# EAGLE design keysweeper_mem_sm (EAGLE 7.5.0)
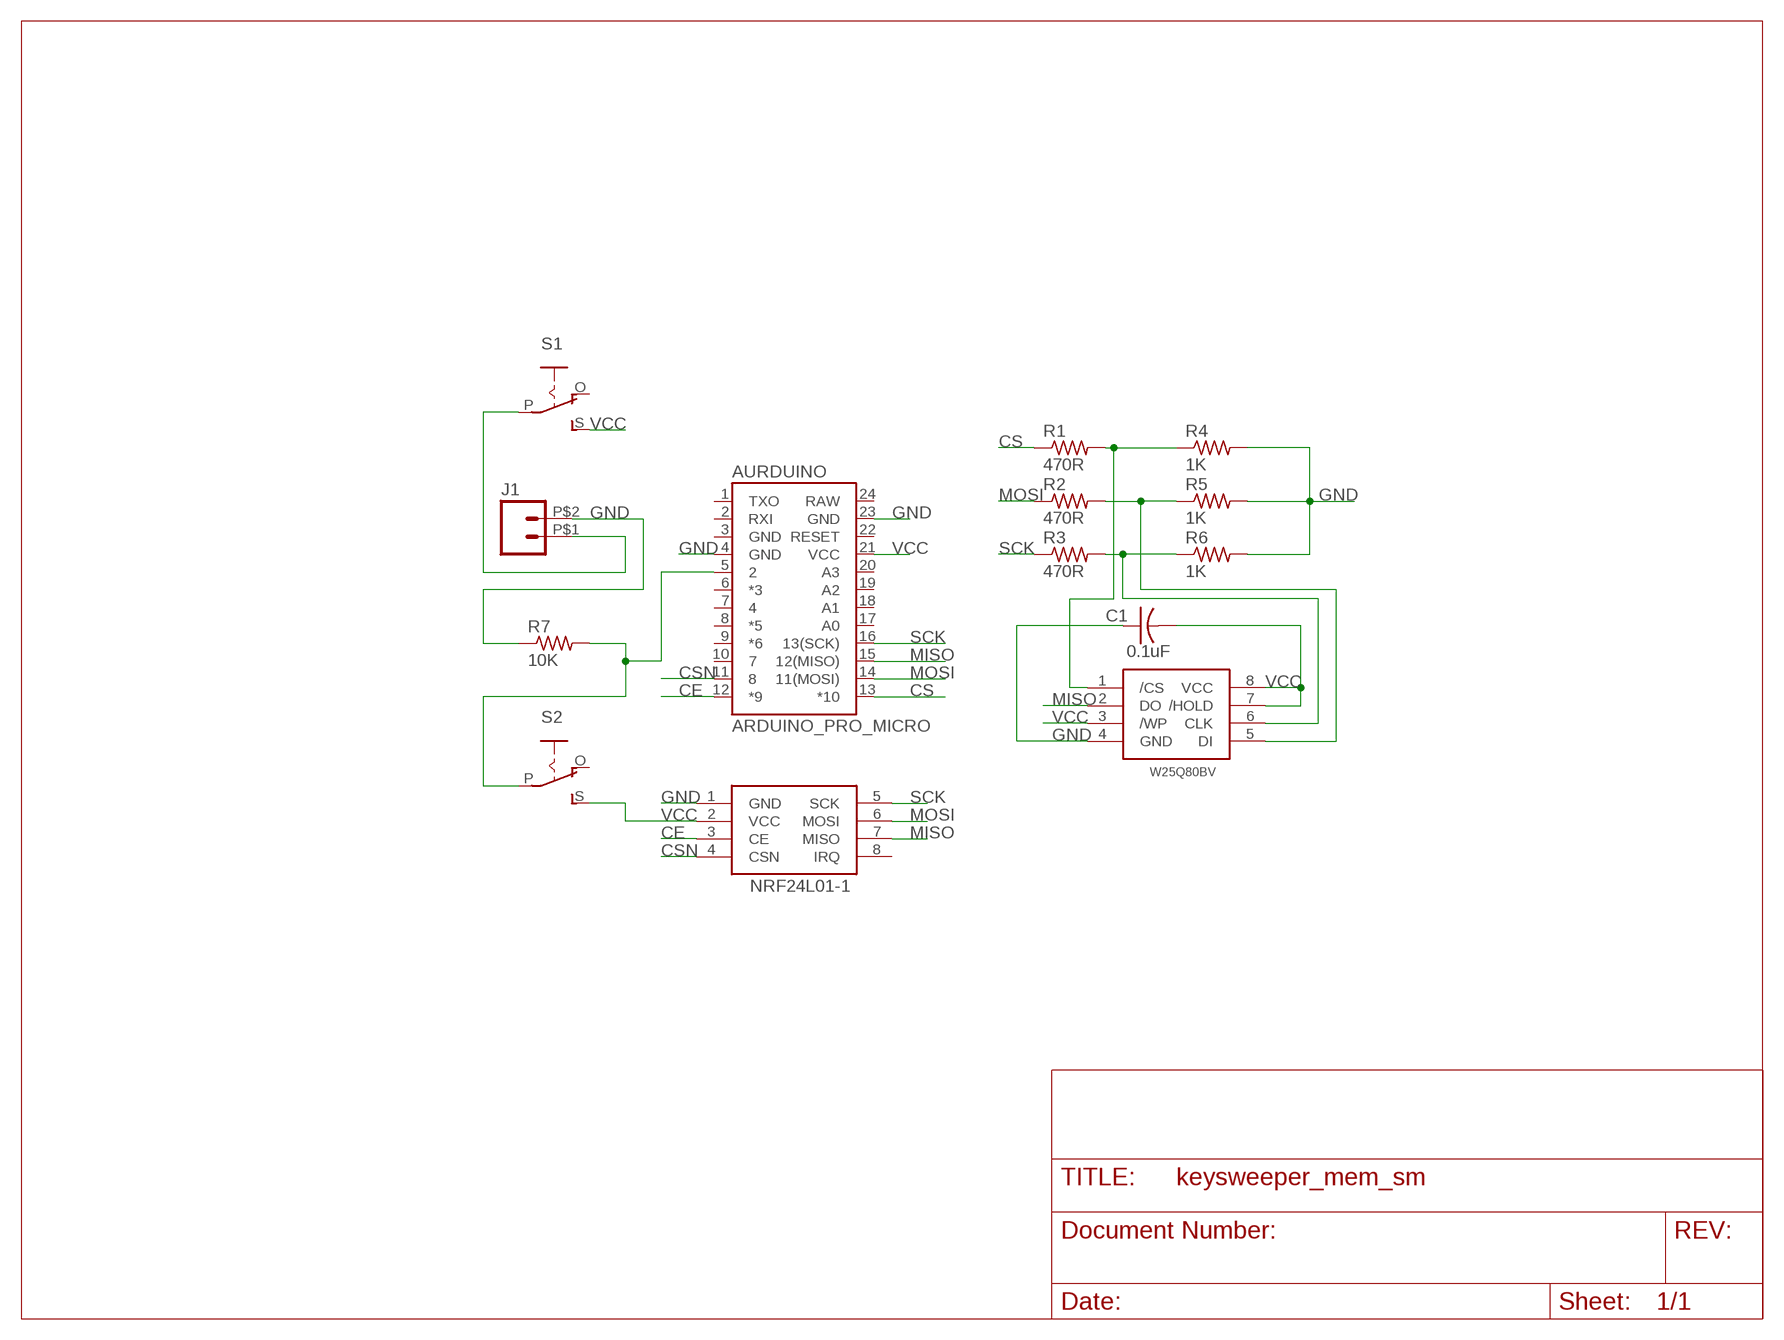
[diagram p0: schematic, sheet 1]

## Parts
AURDUINO  ARDUINO_PRO_MICRO  [ARDUINO_PRO_MICRO]
C1  0.1uF  C-USC0805K  [C0805K]
J1  M02PTH2  [1X02_BIG]
R1  470R  R-US_R0805W  [R0805W]
R2  470R  R-US_R0805W  [R0805W]
R3  470R  R-US_R0805W  [R0805W]
R4  1K  R-US_R0805W  [R0805W]
R5  1K  R-US_R0805W  [R0805W]
R6  1K  R-US_R0805W  [R0805W]
R7  10K  R-US_R0805W  [R0805W]
S1  EG1218S  [EG1218]
S2  EG1218S  [EG1218]
U1  NRF24L01-8PIN  [NRF24L01]
U2  W25Q80BV-SMD  [W25Q80BV-SMD]

## Nets
CE: AURDUINO.12(*9) U1.3(CE)
CS: AURDUINO.13(*10) R1.1
CSN: AURDUINO.11 U1.4(CSN)
GND [power]: AURDUINO.4(GND) AURDUINO.23(GND) C1.1 J1.P$2 R4.2 R5.2 R6.2 R7.1 U1.1(GND) U2.4(GND)
MISO: AURDUINO.15(12(MISO)) U1.7(MISO) U2.2(DO)
MOSI: AURDUINO.14(11(MOSI)) R2.1 U1.6(MOSI)
N$1: R1.2 R4.1 U2.1(/CS)
N$2: R2.2 R5.1 U2.5(DI)
N$3: R3.2 R6.1 U2.6(CLK)
N$5: AURDUINO.5 R7.2 S2.P
N$6: J1.P$1 S1.P
SCK: AURDUINO.16(13(SCK)) R3.1 U1.5(SCK)
VCC [power]: AURDUINO.21(VCC) C1.2 S1.S S2.S U1.2(VCC) U2.3(/WP) U2.7(/HOLD) U2.8(VCC)
Unconnected: AURDUINO.1(TXO) AURDUINO.2(RXI) AURDUINO.3(GND) AURDUINO.6(*3) AURDUINO.7 AURDUINO.8(*5) AURDUINO.9(*6) AURDUINO.10 AURDUINO.17(A0) AURDUINO.18(A1) AURDUINO.19(A2) AURDUINO.20(A3) AURDUINO.22(RESET) AURDUINO.24(RAW) S1.O S2.O U1.8(IRQ)

## Library data of the parts
AURDUINO = SparkFun-Boards:ARDUINO_PRO_MICRO
C1 = adafruit:C-US: CAPACITOR, American symbol
J1 = SparkFun-Connectors:M02: Standard 2-pin 0.1" header. Use with - straight break away headers ( PRT-00116) - right angle break away headers (PRT-00553) - swiss pins (PRT-00743) - machine pins (PRT-00117) - female headers (PRT-00115) Molex polarized connector foot print use with: PRT-08233 with associated crimp pins and housings. 2.54_SCREWTERM for use with PRT-10571. 3.5mm Screw Terminal footprints for PRT-08084 5mm Screw Terminal footprints for use with PRT-08432
R1-R7 = adafruit:R-US_: RESISTOR, American symbol
S1 S2 = adafruit:EG1218: SLIDING SWITCH 0.1" spacing through hole, vertical SPDT slide switch http://www.ladyada.net/library/pcb/eaglelibrary.html
U1 = osok:NRF24L01-8PIN
U2 = osok:W25Q80BV-SMD

## Net classes
0 default: width 0.254 mm
1 power: width 0.508 mm

## Board
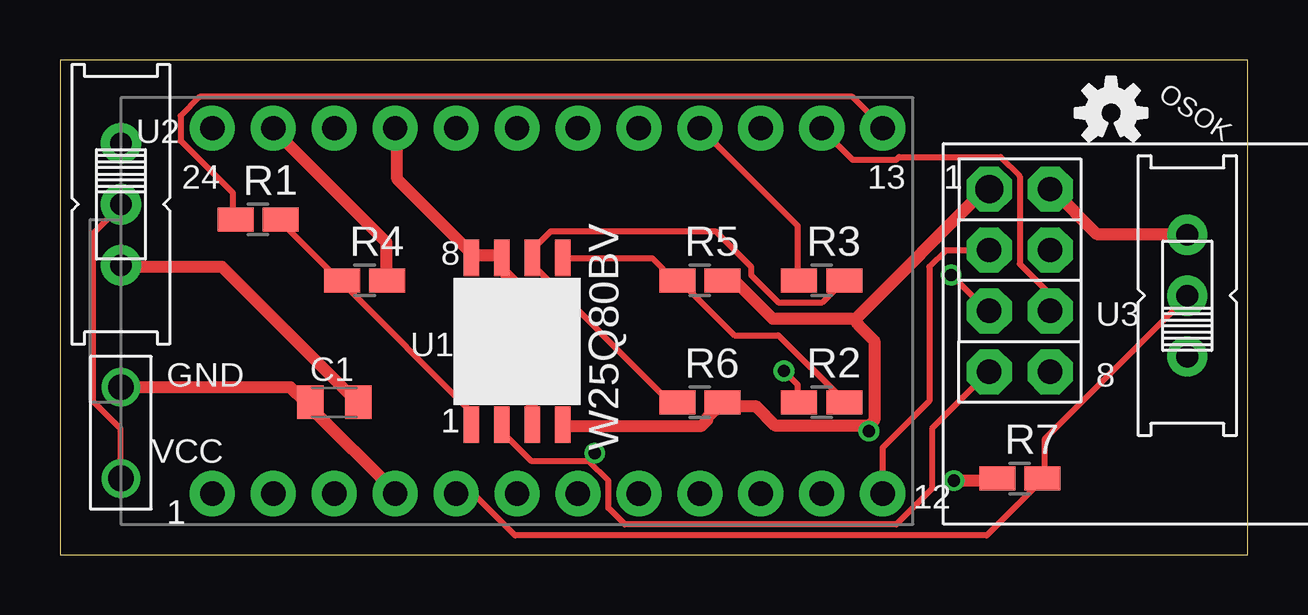
[diagram p1: board, top side]
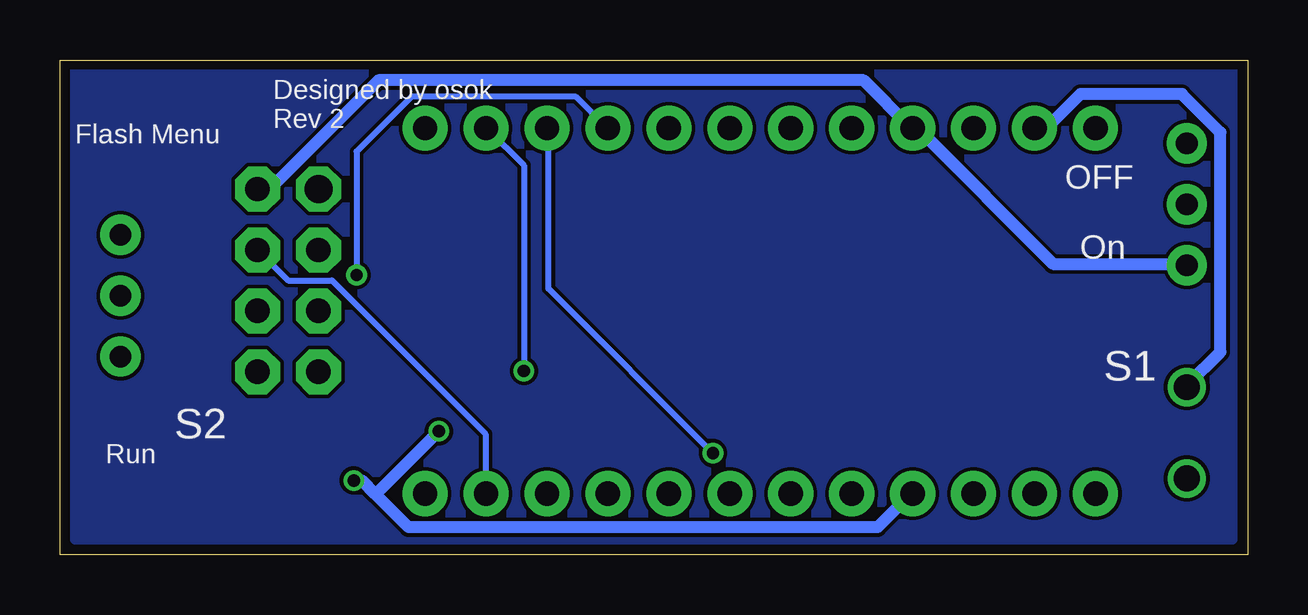
[diagram p2: board, bottom side, seen from below]

Size 49.51 x 20.62 mm. Coordinates in mm from the lower left corner, seen from the top.
Outline: 0,0 49.51,0 49.51,20.62 0,20.62 0,0
Copper layers (1*16): Top 0.0356mm / dielectric 1.5011mm / Bottom 0.0356mm
Design rules "LaenPCBOrder": minimum track width 6mil, minimum drill 13mil, track to track 6mil, track to pad 6mil, pad to pad 6mil, via to via 6mil, smd to smd 6mil, copper to edge 15mil, drill to drill 6mil, minimum pad ring 7mil, minimum via ring 7mil, stop-mask expansion 3mil, vias tented up to drill 0mil, thermal gap 10mil

### Footprints (pad centres in the part's own frame; a part is rotated, then mirrored left to right if it is on the bottom)
ARDUINO_PRO_MICRO = drill 1.016 pad 1.88: 1 -7.62,12.7; 2 -7.62,10.16; 3 -7.62,7.62; 4 -7.62,5.08; 5 -7.62,2.54; 6 -7.62,0; 7 -7.62,-2.54; 8 -7.62,-5.08; 9 -7.62,-7.62; 10 -7.62,-10.16; 11 -7.62,-12.7; 12 -7.62,-15.24; 13 7.62,-15.24; 14 7.62,-12.7; 15 7.62,-10.16; 16 7.62,-7.62; 17 7.62,-5.08; 18 7.62,-2.54; 19 7.62,0; 20 7.62,2.54; 21 7.62,5.08; 22 7.62,7.62; 23 7.62,10.16; 24 7.62,12.7
C0805K = smd 1.1 x 1.4: 1 -1,0; 2 1,0
1X02_BIG = drill 1.067: P$1 0,0; P$2 3.81,0
R0805W = smd 1.5 x 1: 1 -0.94,0; 2 0.94,0
EG1218 = drill 0.9 pad 1.676: O -2.54,0; P 0,0; S 2.54,0
NRF24L01 = drill 1.168 pad 1.88 octagon: 1 1.905,13.97 | drill 1.016 pad 1.88 octagon: 2 4.445,13.97; 3 1.905,11.43; 4 4.445,11.43; 5 1.905,8.89; 6 4.445,8.89; 7 1.905,6.35; 8 4.445,6.35
W25Q80BV-SMD = smd 1.524 x 0.635: 1 -3.48,1.905; 2 -3.48,0.635; 3 -3.48,-0.635; 4 -3.48,-1.905; 5 3.48,-1.905; 6 3.48,-0.635; 7 3.48,0.635; 8 3.48,1.905

### Placement (x,y rotation side)
AURDUINO  19.05,10.16 90 top
C1  11.43,6.35 0 top
J1  2.54,3.17 90 top
R1  8.26,13.97 0 top
R2  31.75,6.35 0 top
R3  31.75,11.43 0 top
R4  12.7,11.43 0 top
R5  26.67,11.43 0 top
R6  26.67,6.35 0 top
R7  40.01,3.17 0 top
S1  2.54,14.61 270 top
S2  46.99,10.79 90 top
U1  36.83,1.27 0 top
U2  19.05,8.89 90 top
U$2  [OSHW-LOGO-S]  43.81,18.41 0 top

### Tracks (layer width: path | path; a pad name or v marks a point on that pad's centre or on a via)
CE
  Top 0.254: AURDUINO.12 34.29,4.46 36.23,6.4 36.23,12 36.92,12.69 38.63,12.69 U1.3
CS
  Top 0.254: R1.1 7.2,14.06 7.2,15.09 5.03,17.26 5.03,18.29 5.83,19.09 33.03,19.09 34.29,17.83 AURDUINO.13
CSN
  Bottom 0.254: U1.4 40.01,11.43 38.18,11.43 31.77,5.03 31.77,2.63 AURDUINO.11
GND  (via drill 0.51)
  Top 0.508: U2.4 21.03,5.37 26.75,5.37 26.98,5.6 26.98,5.71 27.55,6.29 R6.2 27.77,6.17 29.03,6.17 29.83,5.37 33.72,5.37 | R5.2 28.12,11.43 29.72,9.83 33.15,9.83 | 33.15,9.83 38.63,15.32 U1.1 | 33.72,5.37 33.95,5.6 33.95,8.91 33.26,9.6 33.15,9.83 | R4.2 13.6,11.43 13.6,13.03 8.91,17.72 AURDUINO.23 | AURDUINO.4 13.95,2.63 10.52,6.06 10.52,6.29 C1.1 10.17,6.4 9.6,6.97 2.63,6.97 J1.P$2 | v37.26,3.09 38.98,3.09 R7.1 | v33.72,5.14 33.72,5.37
  Bottom 0.508: v37.26,3.09 36.92,3.09 36.35,2.52 | 36.35,2.52 34.98,1.14 15.43,1.14 14.06,2.52 AURDUINO.4 | AURDUINO.23 8.8,17.83 8.34,17.83 6.97,19.2 2.74,19.2 1.14,17.6 1.14,8.46 2.52,7.09 J1.P$2 | 36.35,2.52 v33.72,5.14
MISO  (via drill 0.51)
  Top 0.254: 22.06,3.89 19.66,3.89 18.52,5.03 18.52,5.37 U2.2 | 22.06,3.89 22.86,3.09 22.86,1.94 23.55,1.26 34.86,1.26 36.35,2.74 36.35,5.26 38.63,7.54 U1.7 | v22.29,4.23 22.06,4 22.06,3.89
  Bottom 0.254: v22.29,4.23 29.15,11.09 29.15,17.72 AURDUINO.15
MOSI  (via drill 0.51)
  Top 0.254: v30.18,7.66 30.75,7.09 30.75,6.4 R2.1 | U1.6 41.26,10.17 41.26,10.86 40.01,12.12 40.01,15.77 39.2,16.57 34.98,16.57 34.86,16.46 33.03,16.46 31.77,17.72 AURDUINO.14
  Bottom 0.254: v30.18,7.66 30.18,16.23 31.66,17.72 AURDUINO.14
N$1
  Top 0.254: R1.2 9.14,13.95 11.66,11.43 R4.1 11.77,11.32 17.14,5.94 U2.1
N$2
  Top 0.254: R2.2 32.69,6.4 29.95,9.14 28.12,9.14 25.83,11.43 R5.1 25.6,11.43 24.69,12.34 21.03,12.34 U2.5
N$3
  Top 0.254: R6.1 25.72,6.4 25.38,6.4 19.77,12 19.77,12.34 U2.6 19.77,12.46 19.77,12.8 20.46,13.49 27.32,13.49 28.8,12 28.8,11.66 29.95,10.52 31.77,10.52 R3.2 | R3.2
N$4
  pour Bottom: 0.64,20.32 48.9,20.32 48.9,0.64 0.64,0.64
N$5
  Top 0.254: S2.P 46.98,10.74 41.03,4.8 41.03,3.2 R7.2 40.92,3.09 38.63,0.8 18.97,0.8 17.26,2.52 16.57,2.52 AURDUINO.5
N$6
  Top 0.254: J1.P$1 2.52,3.2 2.52,5.26 1.37,6.4 1.37,13.37 2.52,14.52 S1.P
SCK  (via drill 0.51)
  Top 0.254: R3.1 30.75,11.43 30.75,13.72 26.75,17.72 AURDUINO.16 | v37.15,11.66 38.63,10.17 U1.5
  Bottom 0.254: v37.15,11.66 37.15,16.8 34.86,19.09 28,19.09 26.75,17.83 AURDUINO.16
VCC
  Top 0.508: C1.2 12.34,6.4 6.74,12 2.63,12 S1.S | S2.S 46.98,13.37 43.2,13.37 41.38,15.2 U1.2 | U2.3 19.66,5.49 19.66,10.63 18.4,11.89 18.4,12.12 U2.7 18.4,12.46 17.14,12.46 U2.8 17.03,12.69 14.06,15.66 14.06,17.72 AURDUINO.21
  Bottom 0.508: U1.2 41.26,15.32 40.69,15.32 36.23,19.77 16,19.77 14.06,17.83 AURDUINO.21 13.72,17.72 8.12,12.12 2.63,12.12 S1.S

### Text on the board
tPlace: OSOK | U2 | 24 | 13 | 1 | 8 | U3 | U1 | GND | 8 | 1 | 1 | VCC | 12 | 1
bPlace: Designed by osok / Rev 2 | Flash Menu | OFF | On | Run